# Altium schematic sheet 微四轴.SchDoc: 微四轴
size A4; DocumentNumber: 1; Revision: 樊浩柏; SheetNumber: 1; SheetTotal: 6
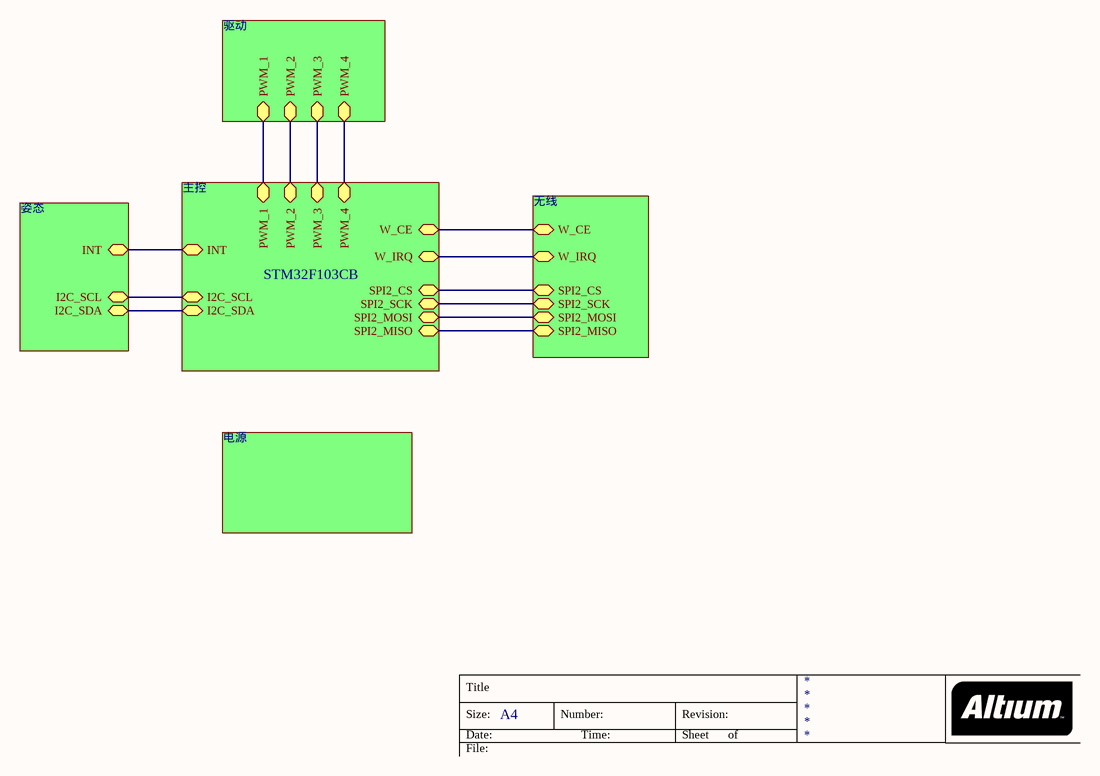
[diagram p0: 微四轴.SchDoc]

## Sub-sheets
主控 = 主控: INT, I2C_SCL, I2C_SDA, PWM_1, PWM_2, PWM_3, PWM_4, W_CE, W_IRQ, SPI2_CS, SPI2_SCK, SPI2_MOSI, SPI2_MISO
姿态 = 姿态: INT, I2C_SDA, I2C_SCL
无线 = 无线: W_CE, W_IRQ, SPI2_CS, SPI2_SCK, SPI2_MOSI, SPI2_MISO
电源 = 电源: no entries
驱动 = 驱动: PWM_1, PWM_2, PWM_3, PWM_4

## Nets
(unnamed): sheet 无线/W_CE, sheet 主控/W_CE
(unnamed): sheet 无线/W_IRQ, sheet 主控/W_IRQ
(unnamed): sheet 无线/SPI2_CS, sheet 主控/SPI2_CS
(unnamed): sheet 无线/SPI2_SCK, sheet 主控/SPI2_SCK
(unnamed): sheet 无线/SPI2_MOSI, sheet 主控/SPI2_MOSI
(unnamed): sheet 无线/SPI2_MISO, sheet 主控/SPI2_MISO
(unnamed): sheet 驱动/PWM_1, sheet 主控/PWM_1
(unnamed): sheet 驱动/PWM_2, sheet 主控/PWM_2
(unnamed): sheet 驱动/PWM_3, sheet 主控/PWM_3
(unnamed): sheet 驱动/PWM_4, sheet 主控/PWM_4
(unnamed): sheet 姿态/INT, sheet 主控/INT
(unnamed): sheet 姿态/I2C_SDA, sheet 主控/I2C_SDA
(unnamed): sheet 姿态/I2C_SCL, sheet 主控/I2C_SCL

## Notes on the sheet
- STM32F103CB
- Title
- Size:
- Date:
- A4
- Number:
- Time:
- Revision:
- Sheet
- of
- *
- File: